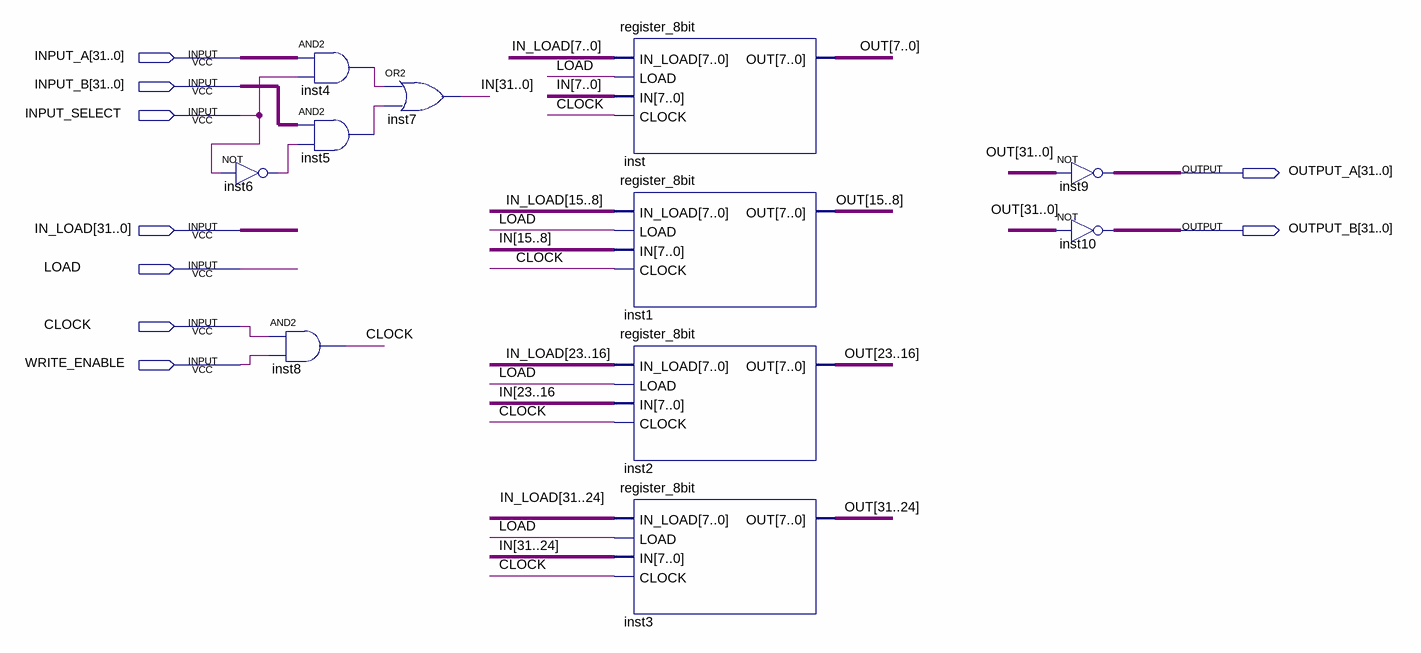
[diagram p0: schematic sheet]
// Quartus schematic register_32bit.bdf as structural Verilog: 11 symbols, 9 pins
module register_32bit (
  input  [31:0] INPUT_A,
  input  [31:0] INPUT_B,
  input  INPUT_SELECT,
  input  [31:0] IN_LOAD,
  input  LOAD,
  input  CLOCK,
  input  WRITE_ENABLE,
  output [31:0] OUTPUT_A,
  output [31:0] OUTPUT_B
);

  wire \IN[23..16 , inst4_out, inst5_out, inst6_out;
  wire [31:0] IN, OUT;

  not inst6 (inst6_out, INPUT_SELECT);
  assign inst4_out = INPUT_A & {32{INPUT_SELECT}};  // AND2 inst4, 32 bits wide
  assign inst5_out = INPUT_B & {32{inst6_out}};  // AND2 inst5, 32 bits wide
  and inst8 (CLOCK, CLOCK, WRITE_ENABLE);
  assign IN = {32{inst4_out}} | {32{inst5_out}};  // OR2 inst7, 32 bits wide
  register_8bit inst (.IN_LOAD(IN_LOAD[7:0]), .LOAD(LOAD), .IN(IN[7:0]), .CLOCK(CLOCK), .OUT(OUT[7:0]));
  register_8bit inst1 (.IN_LOAD(IN_LOAD[15:8]), .LOAD(LOAD), .IN(IN[15:8]), .CLOCK(CLOCK), .OUT(OUT[15:8]));
  register_8bit inst2 (.IN_LOAD(IN_LOAD[23:16]), .LOAD(LOAD), .IN({8{\IN[23..16 }}), .CLOCK(CLOCK), .OUT(OUT[23:16]));
  register_8bit inst3 (.IN_LOAD(IN_LOAD[31:24]), .LOAD(LOAD), .IN(IN[31:24]), .CLOCK(CLOCK), .OUT(OUT[31:24]));
  assign OUTPUT_A = ~OUT;  // NOT inst9, 32 bits wide
  assign OUTPUT_B = ~OUT;  // NOT inst10, 32 bits wide
endmodule
